# EAGLE schematic daGloane (EAGLE 6.2)
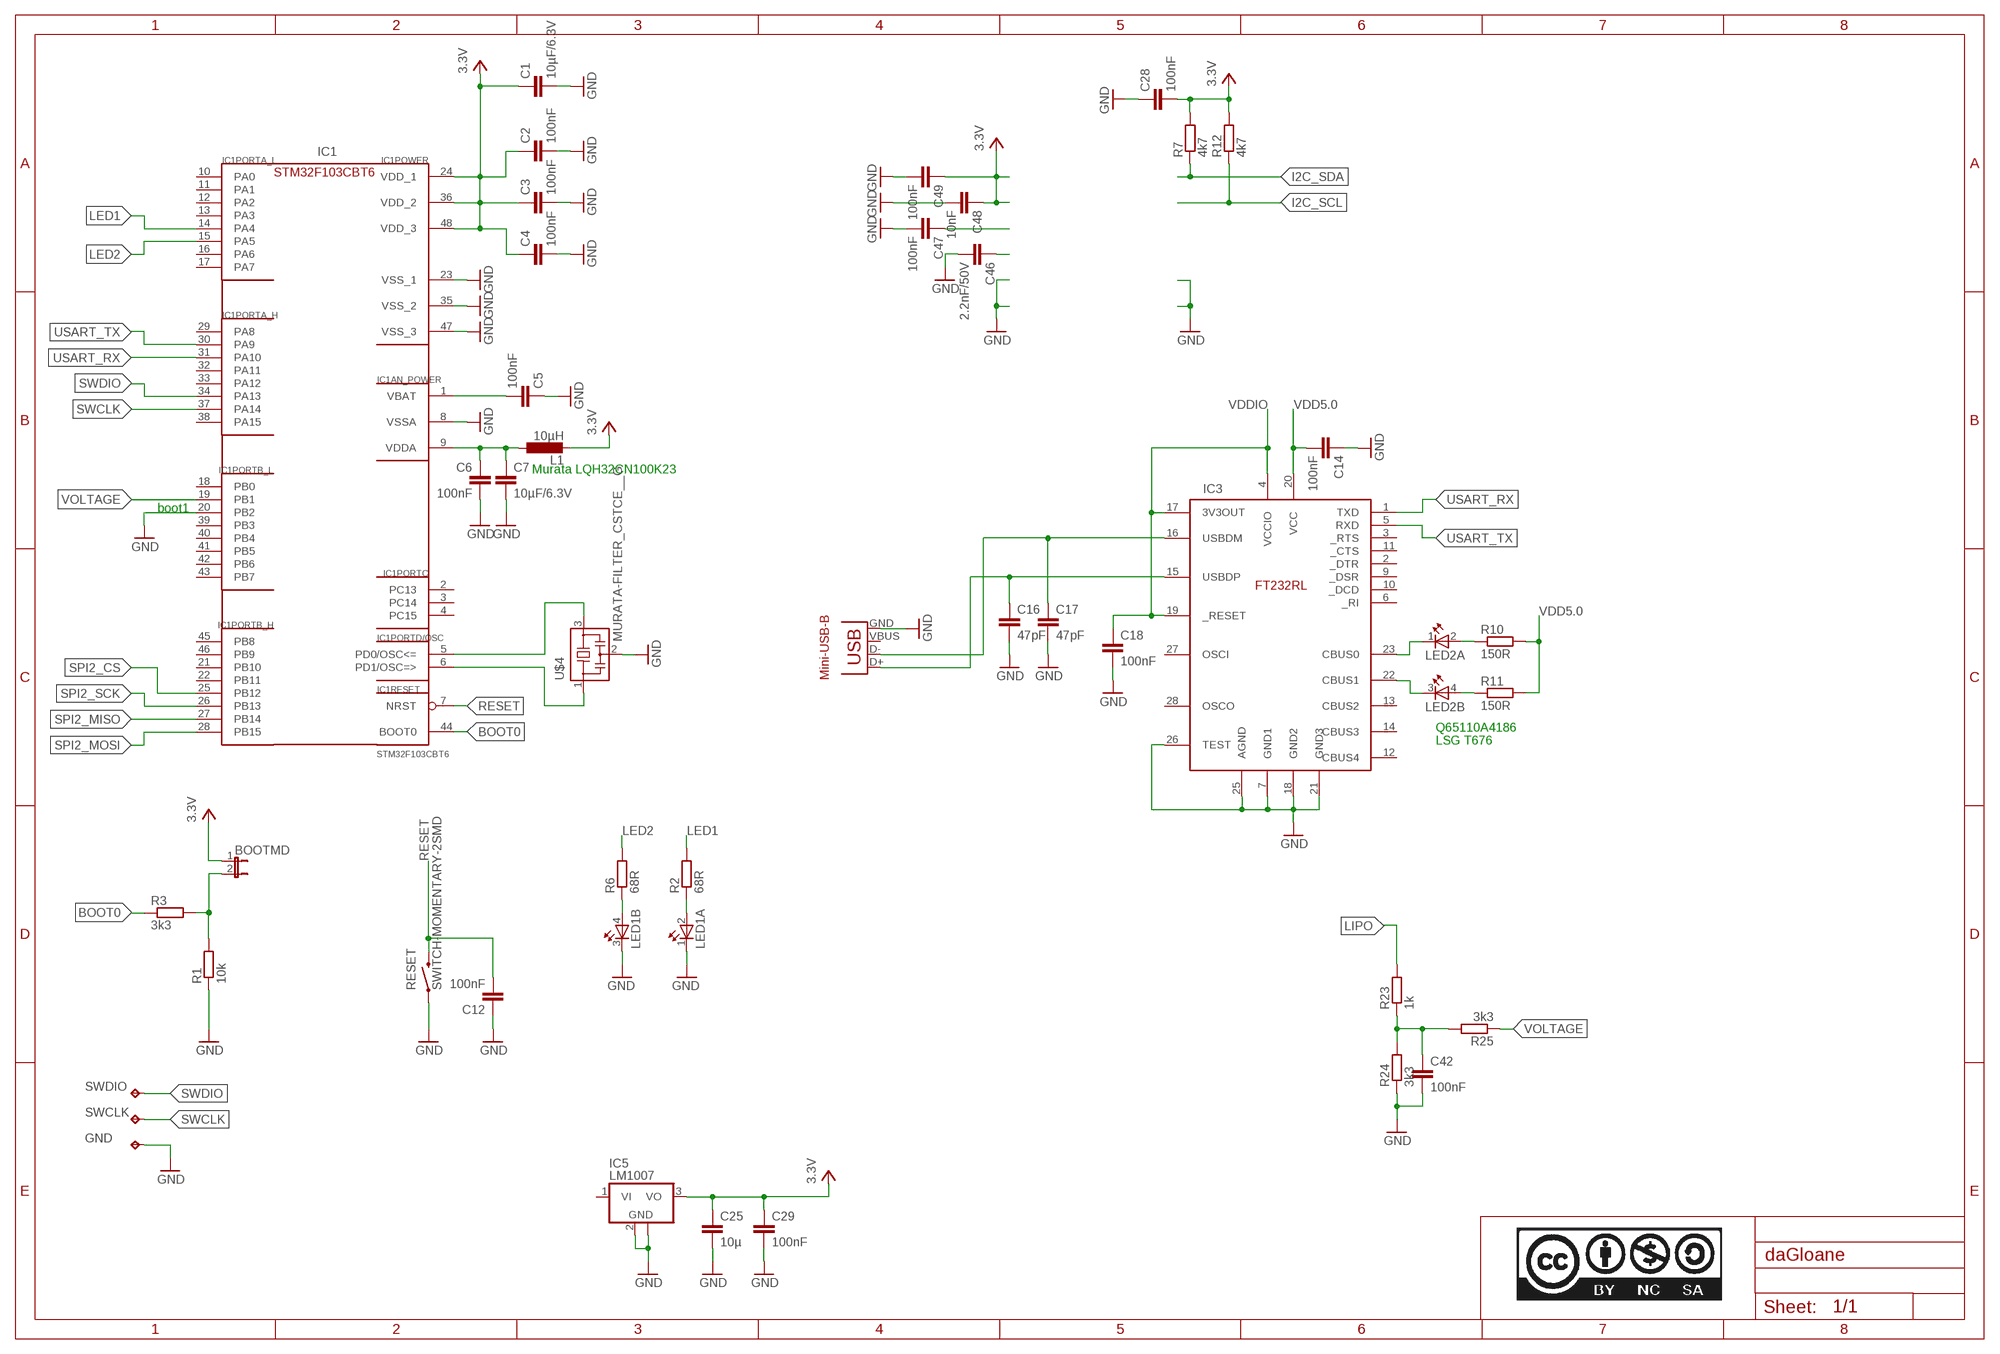
[diagram p0: schematic, sheet 1]

## Parts
BOOTMD  JUMPER-2PTH  [1X02]
C1  10µF/6.3V  C-EUC0805  [C0805]
C2  100nF  C-EUC0805  [C0805]
C3  100nF  C-EUC0805  [C0805]
C4  100nF  C-EUC0805  [C0805]
C5  100nF  C-EUC0805  [C0805]
C6  100nF  C-EUC0805  [C0805]
C7  10µF/6.3V  C-EUC0805  [C0805]
C12  100nF  C-EUC0805  [C0805]
C14  100nF  C-EUC0805  [C0805]
C16  47pF  C-EUC0805  [C0805]
C17  47pF  C-EUC0805  [C0805]
C18  100nF  C-EUC0805  [C0805]
C25  10µ  C-EUC0805  [C0805]
C28  100nF  C-EUC0805  [C0805]
C29  100nF  C-EUC0805  [C0805]
C42  100nF  C-EUC0805  [C0805]
C46  2.2nF/50V  C-EUC0805  [C0805]
C47  100nF  C-EUC0805  [C0805]
C48  10nF  C-EUC0805  [C0805]
C49  100nF  C-EUC0805  [C0805]
GND  TESTPAD_TPB1,27  [TESTPAD_B1,27]
IC1  STM32F103CBT6  STM32F10XCXT6  [TQFP48]
IC3  FT232RL  [SSOP28DB]
IC5  UA78M05DCY  [SOT223]
L1  10µH  L-EUL1210  [R1210]
LED1  TOPLED-2-MPI  [P-LCC-4-2-MPI]
LED2  TOPLED-2-MPI  [P-LCC-4-2-MPI]
R1  10k  R-EU_R0805  [R0805]
R2  68R  R-EU_R0805  [R0805]
R3  3k3  R-EU_R0805  [R0805]
R6  68R  R-EU_R0805  [R0805]
R7  4k7  R-EU_R0805  [R0805]
R10  150R  R-EU_R0805  [R0805]
R11  150R  R-EU_R0805  [R0805]
R12  4k7  R-EU_R0805  [R0805]
R23  1k  R-EU_R0805  [R0805]
R24  3k3  R-EU_R0805  [R0805]
R25  3k3  R-EU_R0805  [R0805]
RESET  SWITCH-MOMENTARY-2SMD  [TACTILE_SWITCH_SMD]
SWCLK  TESTPAD_TPB1,27  [TESTPAD_B1,27]
SWDIO  TESTPAD_TPB1,27  [TESTPAD_B1,27]
U$4  MURATA-FILTER_CSTCE__G  [MURATA-FILTER_CSTCE__G]
USB2  USB-MB-S2  [USB-MP-S2]

## Nets
BOOT0: IC1.44(RESET:BOOT0) R3.1
D+: C16.1 IC3.15(USBDP) USB2.D+
D-: C17.1 IC3.16(USBDM) USB2.D-
GND: C1.2 C2.2 C3.2 C4.2 C5.1 C6.2 C7.2 C12.1 C14.1 C16.2 C17.2 C18.2 C25.2 C28.1 C29.2 C42.2 C46.2 C47.2 C48.2 C49.2 GND.PP(TP) IC1.8(AN_POWER:VSSA) IC1.20(PORTB_L:PB2) IC1.23(POWER:VSS_1) IC1.35(POWER:VSS_2) IC1.47(POWER:VSS_3) IC3.7(GND1) IC3.18(GND2) IC3.21(GND3) IC3.25(AGND) IC3.26(TEST) IC5.2(GND) IC5.4(GND) LED1.1(A:C) LED1.3(B:C) R1.1 R24.1 RESET.1 U$4.2 USB2.GND
I2C_SCL: R12.1
I2C_SDA: R7.1
LED1: IC1.14(PORTA_L:PA4) R2.2
LED2: IC1.15(PORTA_L:PA5) R6.2
LIPO: R23.2
N$1: U$4.1
N$2: IC3.23(CBUS0) LED2.1(A:C)
N$3: IC3.22(CBUS1) LED2.3(B:C)
N$4: LED2.2(A:A) R10.1
N$5: LED2.4(B:A) R11.1
N$6: C46.1
N$7: U$4.3
N$8: LED1.2(A:A) R2.1
N$9: LED1.4(B:A) R6.1
N$10: BOOTMD.2 R1.2 R3.2
N$13: C47.1
N$22: C42.1 R23.1 R24.2 R25.2
RESET: C12.2 IC1.7(RESET:NRST) RESET.3
SPI2_CS: IC1.25(PORTB_H:PB12)
SPI2_MISO: IC1.27(PORTB_H:PB14)
SPI2_MOSI: IC1.28(PORTB_H:PB15)
SPI2_SCK: IC1.26(PORTB_H:PB13)
SWCLK: IC1.37(PORTA_H:PA14) SWCLK.PP(TP)
SWDIO: IC1.34(PORTA_H:PA13) SWDIO.PP(TP)
USART_RX: IC1.31(PORTA_H:PA10) IC3.1(TXD)
USART_TX: IC1.30(PORTA_H:PA9) IC3.5(RXD)
VBAT: C5.2 IC1.1(AN_POWER:VBAT)
VCC: BOOTMD.1 C1.1 C2.1 C3.1 C4.1 C25.1 C28.2 C29.1 C48.1 C49.1 IC1.24(POWER:VDD_1) IC1.36(POWER:VDD_2) IC1.48(POWER:VDD_3) IC5.3(VO) L1.2 R7.2 R12.2 ; supply symbol labelled 3.3V
VDD5.0: C14.2 IC3.20(VCC) R10.2 R11.2
VDDA: C6.1 C7.1 IC1.9(AN_POWER:VDDA) L1.1
VDDIO: C18.1 IC3.4(VCCIO) IC3.17(3V3OUT) IC3.19(_RESET)
VOLTAGE: IC1.19(PORTB_L:PB1) R25.1
Unconnected: IC1.2(PORTC:PC13) IC1.3(PORTC:PC14) IC1.4(PORTC:PC15) IC1.5(PORTD/OSC:PD0/OSC<=) IC1.6(PORTD/OSC:PD1/OSC=>) IC1.10(PORTA_L:PA0) IC1.11(PORTA_L:PA1) IC1.12(PORTA_L:PA2) IC1.13(PORTA_L:PA3) IC1.16(PORTA_L:PA6) IC1.17(PORTA_L:PA7) IC1.18(PORTB_L:PB0) IC1.21(PORTB_H:PB10) IC1.22(PORTB_H:PB11) IC1.29(PORTA_H:PA8) IC1.32(PORTA_H:PA11) IC1.33(PORTA_H:PA12) IC1.38(PORTA_H:PA15) IC1.39(PORTB_L:PB3) IC1.40(PORTB_L:PB4) IC1.41(PORTB_L:PB5) IC1.42(PORTB_L:PB6) IC1.43(PORTB_L:PB7) IC1.45(PORTB_H:PB8) IC1.46(PORTB_H:PB9) IC3.2(_DTR) IC3.3(_RTS) IC3.6(_RI) IC3.9(_DSR) IC3.10(_DCD) IC3.11(_CTS) IC3.12(CBUS4) IC3.13(CBUS2) IC3.14(CBUS3) IC3.27(OSCI) IC3.28(OSCO) IC5.1(VI) USB2.VBUS

## Notes on the sheet
- IC1
- STM32F103CBT6
- Murata LQH32CN100K23
- boot1
- FT232RL
- Mini-USB-B
- Q65110A4186
- LSG T676

## Library data of the parts
BOOTMD = SparkFun:JUMPER-2: Jumper Basic 0.1" spaced jumper. Use with breakaway headers.
C1-C7 C12 C14 C16-C18 C25 C28 C29 C42 C46-C49 = rcl:C-EU: CAPACITOR, European symbol
GND SWCLK SWDIO = bldc_can:TESTPAD_TP: Test pad
IC1 = stm32:STM32F10XCXT6: ST STM32F101/103 48pin LQFP
IC3 = ftdichip:FT232RL: USB UART 4th Generation USB UART (USB <-> Serial) Controller
IC5 = linear:UA78M*: POSITIVE-VOLTAGE REGULATORS Source: http://focus.ti.com/lit/ds/symlink/ua78m33.pdf; LM1007: LM1007
L1 = rcl:L-EU: INDUCTOR, European symbol
LED1 LED2 = led:TOPLED-2-: Multi TOPLED® (two color) LG T672, LP T672 LSY T67B LSW T67C LSY T675 LSY T676 LSG T677 LSG T770 Source: http://www.osram.convergy.de/
R1-R3 R6 R7 R10-R12 R23-R25 = rcl:R-EU_: RESISTOR, European symbol
RESET = SparkFun:SWITCH-MOMENTARY-2
U$4 = canBLC2:MURATA-FILTER_CSTCE__G
USB2 = con-usb:USB: USB Connectors